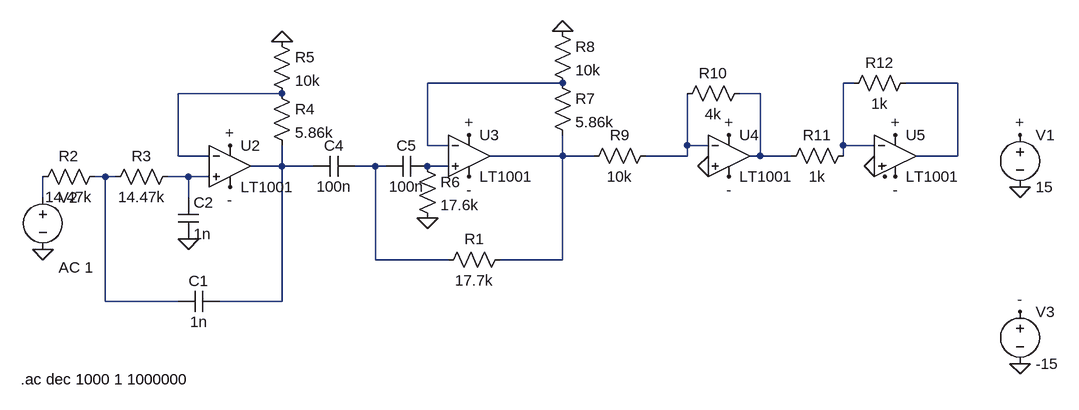
[diagram p0: schematic BPF_402101577.asc]
BPF_402101577.asc, the LTspice schematic file:
Version 4
SHEET 1 1588 680
WIRE 816 -48 608 -48
WIRE 1264 -48 1248 -48
WIRE 1424 -48 1344 -48
WIRE 384 -32 224 -32
WIRE 1120 -32 1088 -32
WIRE 608 48 608 -48
WIRE 640 48 608 48
WIRE 1008 48 1008 -32
WIRE 1040 48 1008 48
WIRE 1248 48 1248 -48
WIRE 1296 48 1248 48
WIRE 224 64 224 -32
WIRE 272 64 224 64
WIRE 816 64 816 32
WIRE 816 64 704 64
WIRE 864 64 816 64
WIRE 1008 64 1008 48
WIRE 1008 64 944 64
WIRE 1120 64 1120 -32
WIRE 1120 64 1104 64
WIRE 1168 64 1120 64
WIRE 1248 64 1248 48
WIRE 1424 64 1424 -48
WIRE 1424 64 1360 64
WIRE 384 80 384 48
WIRE 384 80 336 80
WIRE 432 80 384 80
WIRE 528 80 496 80
WIRE 544 80 528 80
WIRE 640 80 608 80
WIRE 112 96 96 96
WIRE 128 96 112 96
WIRE 240 96 208 96
WIRE 272 96 240 96
WIRE 16 128 16 96
WIRE 240 128 240 96
WIRE 528 224 528 80
WIRE 640 224 528 224
WIRE 816 224 816 64
WIRE 816 224 720 224
WIRE 112 288 112 96
WIRE 224 288 112 288
WIRE 384 288 384 80
WIRE 384 288 288 288
FLAG 240 192 0
FLAG 16 208 0
FLAG 384 -112 0
FLAG 816 -128 0
FLAG 1040 80 0
FLAG 1296 80 0
FLAG 608 160 0
FLAG 1328 32 +
FLAG 1072 32 +
FLAG 672 32 +
FLAG 304 48 +
FLAG 1520 32 +
FLAG 1520 112 0
FLAG 1328 96 -
FLAG 1312 96 -
FLAG 1072 96 -
FLAG 672 96 -
FLAG 304 112 -
FLAG 1520 304 -
FLAG 1520 384 0
SYMBOL voltage 16 112 R0
WINDOW 123 24 124 Left 2
WINDOW 39 0 0 Left 0
SYMATTR InstName V2
SYMATTR Value ""
SYMATTR Value2 AC 1
SYMBOL res 112 80 R90
WINDOW 0 0 56 VBottom 2
WINDOW 3 32 56 VTop 2
SYMATTR InstName R2
SYMATTR Value 14.47k
SYMBOL res 224 80 R90
WINDOW 0 0 56 VBottom 2
WINDOW 3 32 56 VTop 2
SYMATTR InstName R3
SYMATTR Value 14.47k
SYMBOL OpAmps\\LT1001 304 16 R0
SYMATTR InstName U2
SYMBOL OpAmps\\LT1001 672 0 R0
SYMATTR InstName U3
SYMBOL cap 224 128 R0
SYMATTR InstName C2
SYMATTR Value 1n
SYMBOL cap 288 272 R90
WINDOW 0 0 32 VBottom 2
WINDOW 3 32 32 VTop 2
SYMATTR InstName C1
SYMATTR Value 1n
SYMBOL res 368 -48 R0
SYMATTR InstName R4
SYMATTR Value 5.86k
SYMBOL res 368 -128 R0
SYMATTR InstName R5
SYMATTR Value 10k
SYMBOL cap 496 64 R90
WINDOW 0 0 32 VBottom 2
WINDOW 3 32 32 VTop 2
SYMATTR InstName C4
SYMATTR Value 100n
SYMBOL cap 608 64 R90
WINDOW 0 0 32 VBottom 2
WINDOW 3 32 32 VTop 2
SYMATTR InstName C5
SYMATTR Value 100n
SYMBOL res 736 208 R90
WINDOW 0 0 56 VBottom 2
WINDOW 3 32 56 VTop 2
SYMATTR InstName R1
SYMATTR Value 17.7k
SYMBOL res 800 -64 R0
SYMATTR InstName R7
SYMATTR Value 5.86k
SYMBOL res 800 -144 R0
SYMATTR InstName R8
SYMATTR Value 10k
SYMBOL res 960 48 R90
WINDOW 0 0 56 VBottom 2
WINDOW 3 32 56 VTop 2
SYMATTR InstName R9
SYMATTR Value 10k
SYMBOL res 1104 -48 R90
WINDOW 0 0 56 VBottom 2
WINDOW 3 32 56 VTop 2
SYMATTR InstName R10
SYMATTR Value 4k
SYMBOL OpAmps\\LT1001 1072 0 R0
SYMATTR InstName U4
SYMBOL OpAmps\\LT1001 1328 0 R0
SYMATTR InstName U5
SYMBOL res 1264 48 R90
WINDOW 0 0 56 VBottom 2
WINDOW 3 32 56 VTop 2
SYMATTR InstName R11
SYMATTR Value 1k
SYMBOL res 1360 -64 R90
WINDOW 0 0 56 VBottom 2
WINDOW 3 32 56 VTop 2
SYMATTR InstName R12
SYMATTR Value 1k
SYMBOL res 592 64 R0
SYMATTR InstName R6
SYMATTR Value 17.6k
SYMBOL voltage 1520 16 R0
WINDOW 123 0 0 Left 0
WINDOW 39 0 0 Left 0
SYMATTR InstName V1
SYMATTR Value 15
SYMBOL voltage 1520 288 R0
WINDOW 123 0 0 Left 0
WINDOW 39 0 0 Left 0
SYMATTR InstName V3
SYMATTR Value -15
TEXT -18 408 Left 2 !.ac dec 1000 1 1000000

The netlist it stands for:
* BPF_402101577.asc
V2 N013 0 AC 1
R2 N011 N013 14.47k
R3 N012 N011 14.47k
XU2 N012 N004 + - N008 LT1001  ; pins In+ In- V+ V- OUT
XU3 N010 N001 + - N007 LT1001  ; pins In+ In- V+ V- OUT
C2 N012 0 1n
C1 N008 N011 1n
R4 N004 N008 5.86k
R5 0 N004 10k
C4 N009 N008 100n
C5 N010 N009 100n
R1 N007 N009 17.7k
R7 N001 N007 5.86k
R8 0 N001 10k
R9 N006 N007 10k
R10 N005 N006 4k
XU4 0 N006 + - N005 LT1001  ; pins In+ In- V+ V- OUT
XU5 0 N002 + - N003 LT1001  ; pins In+ In- V+ V- OUT
R11 N002 N005 1k
R12 N003 N002 1k
R6 N010 0 17.6k
V1 + 0 15
V3 - 0 -15
.ac dec 1000 1 1000000
.lib LTC.lib
.backanno
.end